# EAGLE design SmartSwitch (EAGLE 7.1.0)
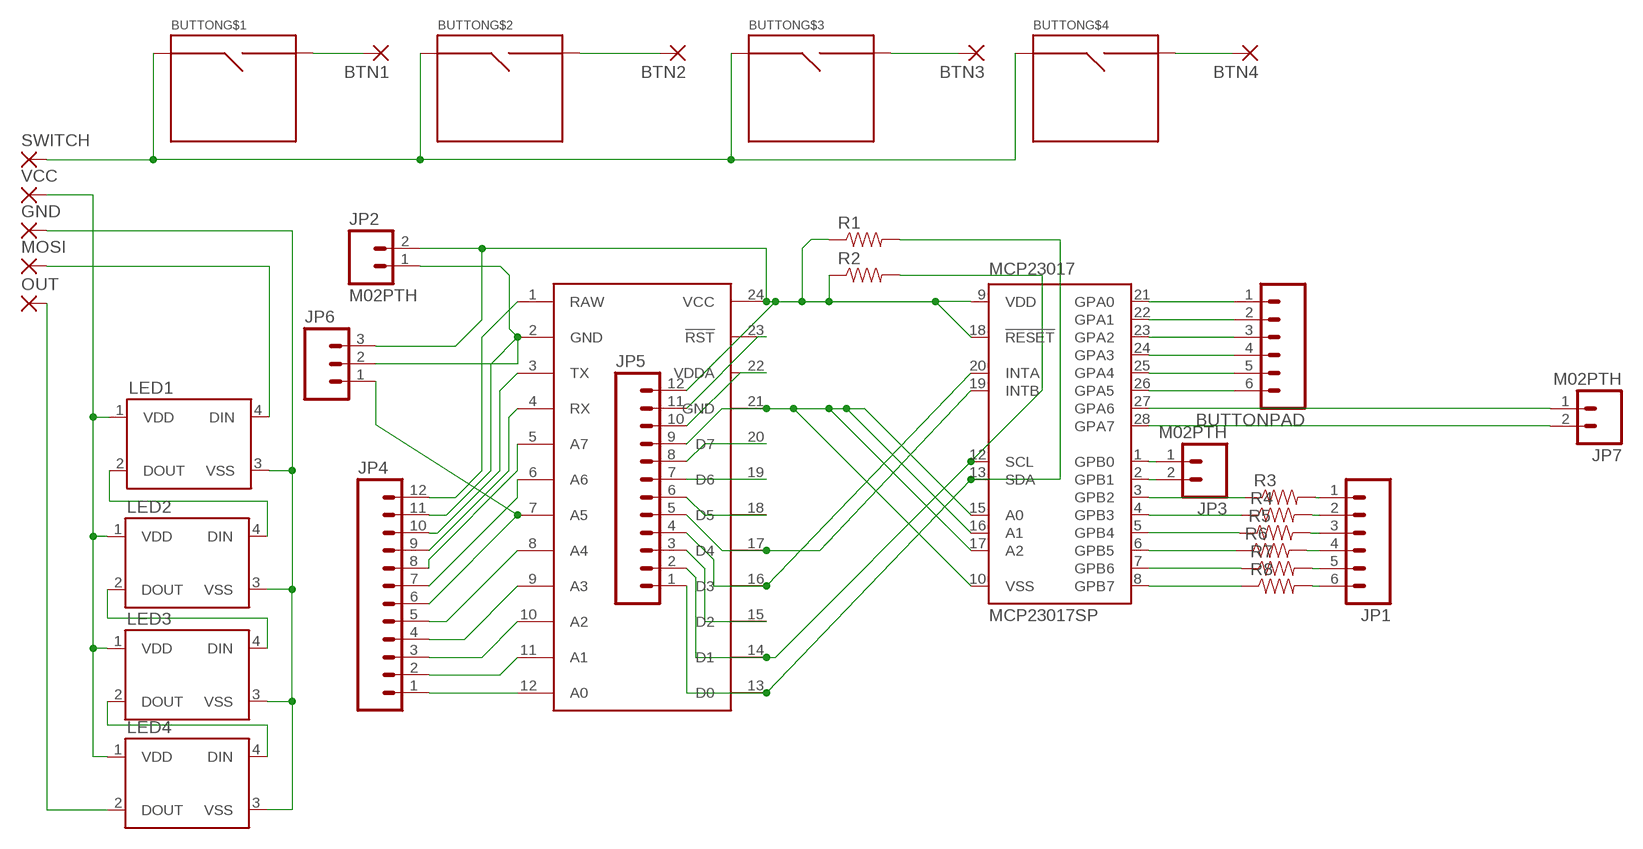
[diagram p0: schematic, sheet 1]

## Parts
BTN1  2,15/1,0  [2,15/1,0]
BTN2  2,15/1,0  [2,15/1,0]
BTN3  2,15/1,0  [2,15/1,0]
BTN4  2,15/1,0  [2,15/1,0]
BUTTON  BUTTON  [BUTTON]
BUTTONPAD  M06SILK_FEMALE_PTH  [1X06]
GND  2,15/1,0  [2,15/1,0]
JP1  M06SILK_FEMALE_PTH  [1X06]
JP2  M02PTH  [1X02]
JP3  M02PTH  [1X02]
JP4  M12PTH  [1X12-SMALL-PADS]
JP5  M12PTH  [1X12-SMALL-PADS]
JP6  M03PTH  [1X03]
JP7  M02PTH  [1X02]
LED1  WS2812B  [WS2812B]
LED2  WS2812B  [WS2812B]
LED3  WS2812B  [WS2812B]
LED4  WS2812B  [WS2812B]
MCP23017  MCP23017SP  [DIL28-3]
MOSI  2,15/1,0  [2,15/1,0]
OUT  2,15/1,0  [2,15/1,0]
R1  RESISTORPTH-1/4W  [AXIAL-0.4]
R2  RESISTORPTH-1/4W  [AXIAL-0.4]
R3  RESISTORPTH-1/4W  [AXIAL-0.4]
R4  RESISTORPTH-1/4W  [AXIAL-0.4]
R5  RESISTORPTH-1/4W  [AXIAL-0.4]
R6  RESISTORPTH-1/4W  [AXIAL-0.4]
R7  RESISTORPTH-1/4W  [AXIAL-0.4]
R8  RESISTORPTH-1/4W  [AXIAL-0.4]
SPARK  SPARK_CORECORE  [SPARK_CORE]
SWITCH  2,15/1,0  [2,15/1,0]
VCC  2,15/1,0  [2,15/1,0]

## Nets
GROUND: GND.1(P) LED1.3(VSS) LED2.3(VSS) LED3.3(VSS) LED4.3(VSS)
MOSI: LED1.4(DIN) MOSI.1(P)
N$1: BTN1.1(P) BUTTON.SIG2
N$2: BTN2.1(P) BUTTON.SIG4(SIG2)
N$3: BTN3.1(P) BUTTON.SIG6(SIG2)
N$4: BTN4.1(P) BUTTON.SIG8(SIG2)
N$5: BUTTONPAD.1 MCP23017.21(GPA0)
N$6: BUTTONPAD.2 MCP23017.22(GPA1)
N$7: BUTTONPAD.3 MCP23017.23(GPA2)
N$8: BUTTONPAD.4 MCP23017.24(GPA3)
N$9: LED4.2(DOUT) OUT.1(P)
N$10: LED1.1(VDD) LED2.1(VDD) LED3.1(VDD) LED4.1(VDD) VCC.1(P)
N$11: LED1.2(DOUT) LED2.4(DIN)
N$12: LED2.2(DOUT) LED3.4(DIN)
N$13: LED3.2(DOUT) LED4.4(DIN)
N$14: BUTTONPAD.5 MCP23017.25(GPA4)
N$15: BUTTONPAD.6 MCP23017.26(GPA5)
N$16: JP7.1 MCP23017.27(GPA6)
N$17: JP7.2 MCP23017.28(GPA7)
N$18: JP3.1 MCP23017.1(GPB0)
N$19: JP3.2 MCP23017.2(GPB1)
N$20: MCP23017.3(GPB2) R3.P$1
N$21: JP1.1 R3.P$2
N$22: JP1.2 R4.P$2
N$23: JP1.3 R5.P$2
N$24: JP1.4 R6.P$2
N$25: JP1.5 R7.P$2
N$26: JP5.3 SPARK.15(D2)
N$27: JP5.5 MCP23017.19(INTB) SPARK.17(D4)
N$28: JP2.2 JP5.12 JP6.3 MCP23017.9(VDD) MCP23017.18(!RESET) R1.P$1 R2.P$1 SPARK.24(VCC)
N$29: JP4.6 JP6.1 SPARK.7(A5)
N$30: JP2.1 JP4.11 JP6.2 SPARK.2(GND)
N$31: JP4.1 SPARK.12(A0)
N$32: JP5.9 MCP23017.10(VSS) MCP23017.15(A0) MCP23017.16(A1) MCP23017.17(A2) SPARK.21(GND)
N$33: JP5.2 MCP23017.12(SCL) R2.P$2 SPARK.14(D1)
N$34: JP5.1 MCP23017.13(SDA) R1.P$2 SPARK.13(D0)
N$35: JP4.2 SPARK.11(A1)
N$36: JP4.3 SPARK.10(A2)
N$37: JP4.4 SPARK.9(A3)
N$38: JP4.5 SPARK.8(A4)
N$39: JP4.7 SPARK.6(A6)
N$40: JP4.8 SPARK.5(A7)
N$41: JP4.9 SPARK.4(RX)
N$42: JP4.10 SPARK.3(TX)
N$43: JP5.6 SPARK.18(D5)
N$44: JP4.12 SPARK.1(RAW)
N$45: JP1.6 R8.P$2
N$46: JP5.8 SPARK.20(D7)
N$47: JP5.7 SPARK.19(D6)
N$48: JP5.10 SPARK.22(VDDA)
N$49: JP5.11 SPARK.23(!RST)
N$50: BUTTON.SIG1 BUTTON.SIG3(SIG1) BUTTON.SIG5(SIG1) BUTTON.SIG7(SIG1) SWITCH.1(P)
N$51: JP5.4 MCP23017.20(INTA) SPARK.16(D3)
N$52: MCP23017.8(GPB7) R8.P$1
N$53: MCP23017.7(GPB6) R7.P$1
N$54: MCP23017.6(GPB5) R6.P$1
N$55: MCP23017.5(GPB4) R5.P$1
N$56: MCP23017.4(GPB3) R4.P$1

## Library data of the parts
BTN1-BTN4 GND MOSI OUT SWITCH VCC = wirepad:2,15/1,0: THROUGH-HOLE PAD
BUTTON = TestLibrary:BUTTON
BUTTONPAD JP1 = SparkFun-Connectors:M06: Header 6 Standard 6-pin 0.1" header. Use with straight break away headers (SKU : PRT-00116), right angle break away headers (PRT-00553), swiss pins (PRT-00743), machine pins (PRT-00117), and female headers (PRT-00115). Molex polarized connector foot print use with SKU : PRT-08094 with associated crimp pins and housings. NOTES ON THE VARIANTS LOCK and LOCK_LONGPADS... This footprint was designed to help hold the alignment of a through-hole component (i.e. 6-pin header) while soldering it into place. You may notice that each hole has been shifted either up or down by 0.005 of an inch from it's more standard position (which is a perfectly straight line). This slight alteration caused the pins (the squares in the middle) to touch the edges of the holes. Because they are alternating, it causes a "brace" to hold the component in place. 0.005 has proven to be the perfect amount of "off-center" position when using our standard breakaway headers. Although looks a little odd when you look at the bare footprint, once you have a header in there, the alteration is very hard to notice. Also,if you push a header all the way into place, it is covered up entirely on the bottom side. This idea of altering the position of holes to aid alignment will be further integrated into the Sparkfun Library for other footprints. It can help hold any component with 3 or more connection pins.; PROD_ID: CONN-08437
JP2 JP3 JP7 = SparkFun-Connectors:M02: Standard 2-pin 0.1" header. Use with - straight break away headers ( PRT-00116) - right angle break away headers (PRT-00553) - swiss pins (PRT-00743) - machine pins (PRT-00117) - female headers (PRT-00115) Molex polarized connector foot print use with: PRT-08233 with associated crimp pins and housings. 2.54_SCREWTERM for use with PRT-10571. 3.5mm Screw Terminal footprints for PRT-08084 5mm Screw Terminal footprints for use with PRT-08432
JP4 JP5 = Spark:M12: Header 12 Standard 12-pin 0.1" header. Use with straight break away headers (SKU : PRT-00116), right angle break away headers (PRT-00553), swiss pins (PRT-00743), machine pins (PRT-00117), and female headers (PRT-00115).
JP6 = SparkFun-Connectors:M03: Header 3 Standard 3-pin 0.1" header. Use with straight break away headers (SKU : PRT-00116), right angle break away headers (PRT-00553), swiss pins (PRT-00743), machine pins (PRT-00117), and female headers (PRT-00115). Molex polarized connector foot print use with SKU : PRT-08232 with associated crimp pins and housings.
LED1-LED4 = SparkFun-LED:WS2812B: WS2812B - Intelligent control LED integrated light source Technical Specifications: Power Supply Voltage (VDD): 3.5 to 5.3 V Input Voltage (VI): -0.5 to VDD+0.5 V Operating Junction Temperature (Topt): -25°C to +80°C Storage Temperature Range (Tstg): -55°C to +150°C
MCP23017 = adafruit:MCP23017: http://ww1.microchip.com/downloads/en/DeviceDoc/21952a.pdf Source: http://ww1.microchip.com/downloads/en/DeviceDoc/21952a.pdf
R1-R8 = SparkFun-Resistors:RESISTOR: Resistor Basic schematic elements and footprints for 0603, 1206, and PTH resistors.
SPARK = Spark:SPARK_CORE

## Board
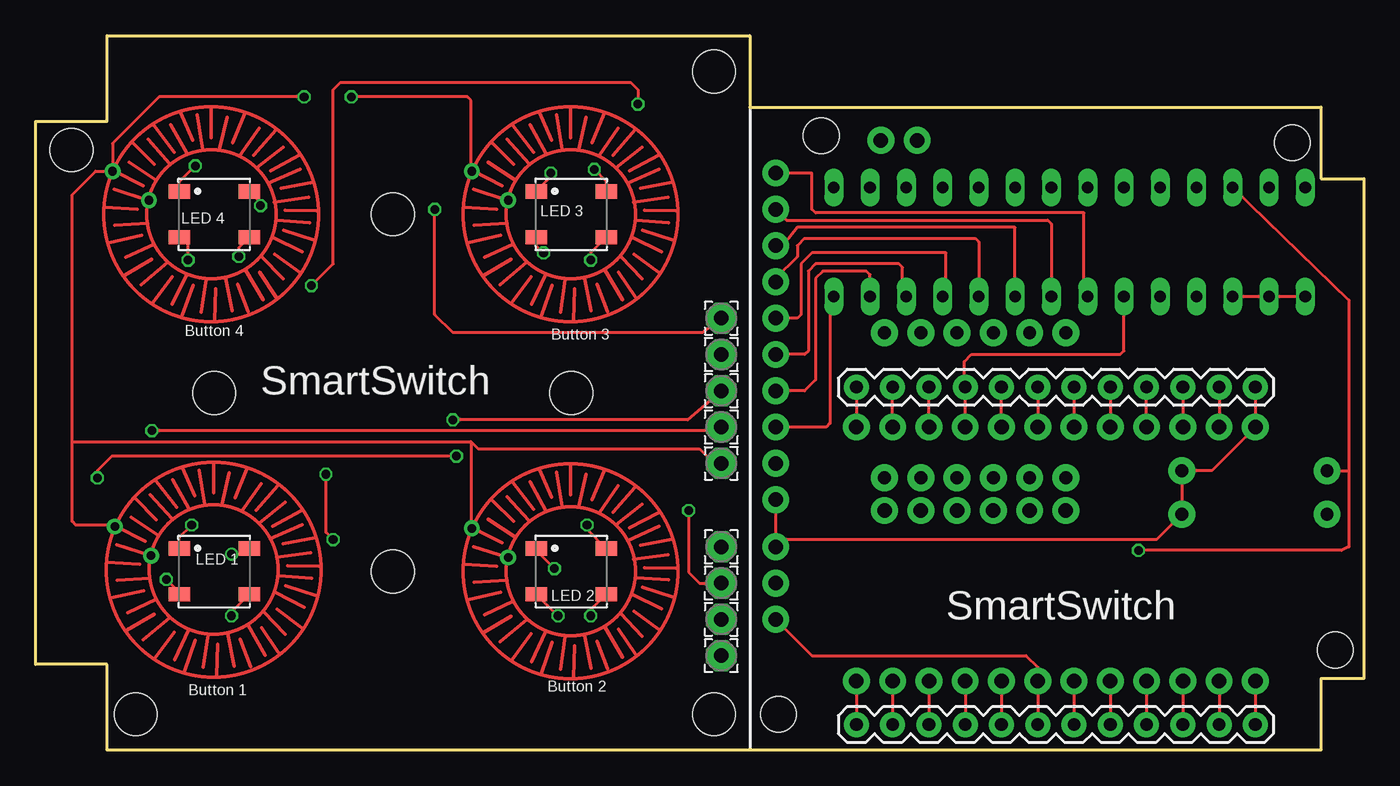
[diagram p1: board, top side]
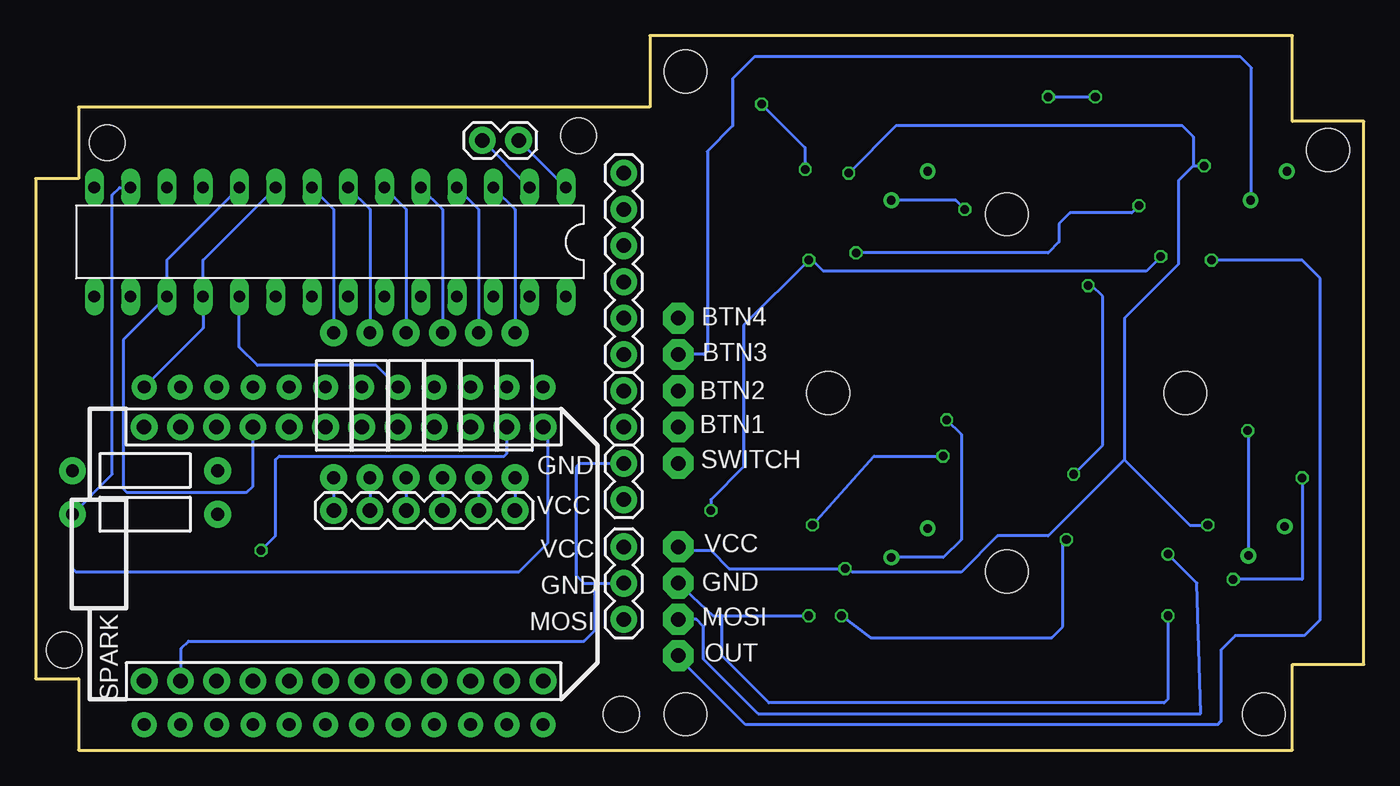
[diagram p2: board, bottom side, seen from below]

Size 93 x 50 mm. Coordinates in mm from the lower left corner, seen from the top.
Outline: 0,6 0,44 5,44 5,50 50,50 50,45 90,45 90,40 93,40 93,5 90,5 90,0 5,0 5,6 0,6
Copper layers (1*16): Top 0.035mm / dielectric 1.5mm / Bottom 0.035mm
Design rules "ITEADstudio_DRC": minimum track width 6mil, minimum drill 12mil, track to track 6mil, track to pad 6mil, pad to pad 6mil, via to via 6mil, smd to smd 0mil, copper to edge 10mil, drill to drill 10mil, minimum pad ring 10mil, minimum via ring 6mil, stop-mask expansion 2mil, vias tented up to drill 100mil, thermal gap 10mil
Holes 3 mm at 12.5,25 25,37.5 37.5,25 25,12.5 7,2.5 2.5,42 47.5,47.5 47.5,2.5
Holes 2.5 mm at 88,42.5 91,7 55,43 52,2.5

### Footprints (pad centres in the part's own frame; a part is rotated, then mirrored left to right if it is on the bottom)
2,15/1,0 = drill 1.016 pad 2.159 octagon: 1 0,0
BUTTON = drill 0.6: SIG1 5.542,15.64; SIG2 8.082,13.608; SIG3 30.542,15.513; SIG4 33.082,13.481; SIG5 5.388,40.513; SIG6 7.928,38.481; SIG7 30.542,40.513; SIG8 33.082,38.481
1X06 = drill 1.016 pad 1.88: 1 0,0; 2 2.54,0; 3 5.08,0; 4 7.62,0; 5 10.16,0; 6 12.7,0
1X02 = drill 1.016 pad 1.88: 1 0,0; 2 2.54,0
1X12-SMALL-PADS = drill 0.889 pad 1.753: 1 0,0; 2 2.54,0; 3 5.08,0; 4 7.62,0; 5 10.16,0; 6 12.7,0; 7 15.24,0; 8 17.78,0; 9 20.32,0; 10 22.86,0; 11 25.4,0; 12 27.94,0
1X03 = drill 1.016 pad 1.88: 1 0,0; 2 2.54,0; 3 5.08,0
WS2812B = smd 1.5 x 1: 1 -2.45,1.6; 2 -2.45,-1.6; 3 2.45,-1.6; 4 2.45,1.6
DIL28-3 = drill 0.813 long: 1 -16.51,-3.81; 2 -13.97,-3.81; 3 -11.43,-3.81; 4 -8.89,-3.81; 5 -6.35,-3.81; 6 -3.81,-3.81; 7 -1.27,-3.81; 8 1.27,-3.81; 9 3.81,-3.81; 10 6.35,-3.81; 11 8.89,-3.81; 12 11.43,-3.81; 13 13.97,-3.81; 14 16.51,-3.81; 15 16.51,3.81; 16 13.97,3.81; 17 11.43,3.81; 18 8.89,3.81; 19 6.35,3.81; 20 3.81,3.81; 21 1.27,3.81; 22 -1.27,3.81; 23 -3.81,3.81; 24 -6.35,3.81; 25 -8.89,3.81; 26 -11.43,3.81; 27 -13.97,3.81; 28 -16.51,3.81
AXIAL-0.4 = drill 0.9 pad 1.88: P$1 -5.08,0; P$2 5.08,0
SPARK_CORE = drill 1.016 pad 1.88: 1 -8.89,13.97; 2 -8.89,11.43; 3 -8.89,8.89; 4 -8.89,6.35; 5 -8.89,3.81; 6 -8.89,1.27; 7 -8.89,-1.27; 8 -8.89,-3.81; 9 -8.89,-6.35; 10 -8.89,-8.89; 11 -8.89,-11.43; 12 -8.89,-13.97; 13 8.89,-13.97; 14 8.89,-11.43; 15 8.89,-8.89; 16 8.89,-6.35; 17 8.89,-3.81; 18 8.89,-1.27; 19 8.89,1.27; 20 8.89,3.81; 21 8.89,6.35; 22 8.89,8.89; 23 8.89,11.43; 24 8.89,13.97

### Placement (x,y rotation side)
BTN1  48.01,22.61 90 top
BTN2  48.01,25.15 90 top
BTN3  48.01,27.69 90 top
BTN4  48.01,30.23 90 top
BUTTON  0,0 0 top
BUTTONPAD  51.82,40.39 270 bottom
GND  48.01,11.68 270 top
JP1  59.44,16.76 180 bottom
JP2  51.82,20.07 270 bottom
JP3  59.18,42.67 180 bottom
JP4  57.47,1.78 0 top
JP5  57.47,25.4 0 top
JP6  51.82,9.14 90 bottom
JP7  51.82,25.15 270 bottom
LED1  12.5,12.5 0 top
LED2  37.5,12.5 0 top
LED3  37.5,37.5 0 top
LED4  12.5,37.5 0 top
MCP23017  72.39,35.56 180 bottom
MOSI  48.01,9.14 270 top
OUT  48.01,6.6 270 top
R1  85.34,16.51 180 bottom
R2  85.34,19.56 180 bottom
R3  59.44,24.13 270 bottom
R4  61.98,24.13 270 bottom
R5  64.52,24.13 270 bottom
R6  67.06,24.13 270 bottom
R7  69.6,24.13 270 bottom
R8  72.14,24.13 270 bottom
SPARK  71.44,13.72 90 bottom
SWITCH  48.01,20.07 180 top
VCC  48.01,14.22 90 top

### Tracks (layer width: path | path; a pad name or v marks a point on that pad's centre or on a via)
GROUND  (via drill 0.6)
  Top 0.203: LED1.3 13.72,9.67 v13.72,9.4 | LED2.3 38.86,9.81 v38.86,9.4 | LED3.3 38.86,34.81 v38.86,34.29 | v45.72,16.76 45.72,12.45 46.48,11.68 GND.1 | LED4.3 14.22,35.17 v14.22,34.54
  Bottom 0.203: GND.1 45.58,9.4 44.96,9.4 | 44.96,9.4 v38.86,9.4 | v13.72,9.4 13.72,3.56 13.97,3.3 41.66,3.3 44.96,6.6 44.96,9.4 | v14.22,34.54 15.24,33.53 37.85,33.53 38.61,34.29 v38.86,34.29 43.43,29.72 43.43,19.81 45.72,17.53 v45.72,16.76
MOSI  (via drill 0.6)
  Top 0.203: v13.72,13.72 14.57,13.72 LED1.4
  Bottom 0.203: v13.72,13.72 11.68,11.68 11.43,2.54 42.42,2.54 46.23,6.35 46.23,8.64 46.74,9.14 MOSI.1
N$1  (via drill 0.6)
  Top 0.203: BTN1.1 46.92,22.35 v8.13,22.35
  Bottom 0.203: v8.13,22.35 8.08,21.8 BUTTON.SIG2
N$2  (via drill 0.6)
  Top 0.203: BTN2.1 45.65,23.11 v29.21,23.11
  Bottom 0.203: v29.21,23.11 28.19,22.1 28.19,14.73 29.45,13.48 BUTTON.SIG4
N$3
  Bottom 0.203: BUTTON.SIG6 7.87,38.53 7.87,47.75 8.64,48.51 42.67,48.51 44.2,46.99 44.2,43.69 45.97,41.91 45.97,27.94 46.23,27.69 BTN3.1
N$4  (via drill 0.6)
  Top 0.203: BTN4.1 46.67,29.21 29.21,29.21 27.94,30.48 v27.94,37.85
  Bottom 0.203: v27.94,37.85 28.57,38.48 BUTTON.SIG8
N$5
  Top 0.203: MCP23017.21 73.41,32 73.41,37.59 54.61,37.59 54.36,37.85 54.36,40.39 BUTTONPAD.1
N$6
  Top 0.203: BUTTONPAD.2 52.58,37.08 70.87,37.08 71.12,36.83 MCP23017.22
N$7
  Top 0.203: MCP23017.23 68.58,36.58 53.34,36.58 52.32,35.31 BUTTONPAD.3
N$8
  Top 0.203: MCP23017.24 66.04,35.56 65.79,35.81 53.85,35.81 53.34,35.31 53.34,34.54 51.82,33.02 BUTTONPAD.4
N$9  (via drill 0.6)
  Top 0.203: v10.67,34.29 10.67,35.81 10.58,35.9 LED4.2
  Bottom 0.203: v10.67,34.29 4.32,34.29 3.05,33.02 3.05,9.11 4.16,8 9,8 10,7 10,2 10.22,1.78 43.29,1.78 48.01,6.5 OUT.1
N$10  (via drill 0.6)
  Top 0.203: LED4.1 10.05,39.77 v11.18,40.89 | v36.07,40.39 36.07,40.12 LED3.1 | LED1.1 10.05,14.88 v10.92,15.75 | v36.32,12.7 35.05,13.97 LED2.1
  Bottom 0.203: v36.07,40.39 32.77,43.69 12.7,43.69 11.94,42.93 11.94,40.89 | 16.76,20.32 16.76,30.23 12.95,34.04 12.95,39.88 11.94,40.89 | 16.76,20.32 12.19,15.75 v10.92,15.75 | VCC.1 47.61,13.97 45.72,13.97 44.45,12.7 v36.32,12.7 36.07,12.7 35.81,12.45 28.19,12.45 25.65,14.99 22.1,14.99 16.76,20.32 | 11.94,40.89 v11.18,40.89
N$11  (via drill 0.6)
  Top 0.203: LED2.4 38.61,15.44 v38.61,15.75 | v29.46,20.57 5.33,20.57 4.32,19.56 v4.32,19.05 | v9.14,11.94 10.05,11.03 LED1.2
  Bottom 0.203: v38.61,15.75 34.29,20.57 v29.46,20.57 | v4.32,19.05 4.32,11.94 v9.14,11.94
N$12  (via drill 0.6)
  Top 0.203: LED2.2 35.81,10.14 v36.58,9.4 | v20.83,14.73 20.32,15.24 v20.32,19.3 | v19.3,32.51 20.83,34.04 20.83,46.23 21.34,46.74 41.66,46.74 42.16,46.23 v42.16,45.21 | v39.12,40.64 39.95,39.81 LED3.4
  Bottom 0.203: v36.58,9.4 34.54,7.87 21.84,7.87 21.08,8.64 21.08,14.48 v20.83,14.73 | v20.32,19.3 18.29,21.34 18.29,31.75 19.05,32.51 v19.3,32.51 | v42.16,45.21 39.12,42.16 v39.12,40.64
N$13  (via drill 0.6)
  Top 0.203: LED4.4 15.75,38.3 v15.75,38.1 | v35.56,34.8 35.05,35.31 LED3.2
  Bottom 0.203: v15.75,38.1 16.26,37.59 20.57,37.59 21.34,36.83 21.34,35.56 22.1,34.8 v35.56,34.8
N$14
  Top 0.203: MCP23017.25 63.75,32 63.75,34.8 54.36,34.8 53.59,34.04 53.59,30.48 53.34,30.23 BUTTONPAD.5
N$15
  Top 0.203: MCP23017.26 60.71,32 60.71,33.78 60.45,34.04 54.61,34.04 54.1,33.53 54.1,27.94 53.85,27.69 BUTTONPAD.6
N$16
  Top 0.203: MCP23017.27 58.42,33.27 58.17,33.53 55.12,33.53 54.61,33.02 54.61,25.91 53.85,25.15 JP7.1
N$17
  Top 0.203: MCP23017.28 55.63,31.5 55.63,22.86 55.37,22.61 JP7.2
N$18
  Bottom 0.203: JP3.1 MCP23017.1
N$19
  Bottom 0.203: JP3.2 MCP23017.2
N$20
  Bottom 0.203: MCP23017.3 59.44,37.85 R3.P$1
N$21
  Bottom 0.203: R3.P$2 JP1.1
N$22
  Bottom 0.203: R4.P$2 JP1.2
N$23
  Bottom 0.203: R5.P$2 JP1.3
N$24
  Bottom 0.203: R6.P$2 JP1.4
N$25
  Bottom 0.203: R7.P$2 JP1.5
N$26
  Top 0.203: SPARK.15 JP5.3
N$27
  Top 0.203: SPARK.17 JP5.5
  Bottom 0.203: JP5.5 69.15,26.92 77.47,26.92 78.74,28.19 MCP23017.19
N$28
  Top 0.203: JP5.12 SPARK.24 82.36,19.56 R2.P$1 R1.P$1 78.49,14.73 51.82,14.73 | JP2.2 51.82,14.73 | 51.82,14.73 JP6.3
  Bottom 0.203: MCP23017.9 81.28,34.29 MCP23017.18 81.28,29.53 JP5.12
N$29
  Top 0.203: JP4.6 SPARK.7 70.17,5.78 69.34,6.6 54.36,6.6 JP6.1
N$30
  Top 0.203: SPARK.2 JP4.11
  Bottom 0.203: JP2.1 54.86,20.07 55.12,19.81 55.12,12.19 54.61,11.68 53.85,11.68 | 53.85,11.68 JP6.2 | SPARK.2 82.8,4.89 82.8,7.11 82.3,7.62 54.61,7.62 53.85,8.38 53.85,11.68
N$31
  Top 0.203: SPARK.12 JP4.1
N$32
  Top 0.203: SPARK.21 JP5.9 | MCP23017.17 MCP23017.16 MCP23017.15
  Bottom 0.203: MCP23017.10 83.82,34.29 MCP23017.17 86.87,28.7 86.87,18.29 86.61,18.03 78.23,18.03 77.79,18.48 SPARK.21
N$33  (via drill 0.6)
  Top 0.203: SPARK.14 JP5.2 | MCP23017.12 91.95,31.5 91.95,19.56 | 91.95,19.56 91.95,14.22 91.44,13.97 v77.22,13.97 | R2.P$2 91.95,19.56
  Bottom 0.203: v77.22,13.97 76.2,14.99 76.2,20.32 75.95,20.57 60.2,20.57 60.01,20.76 SPARK.14
N$34
  Top 0.203: JP5.1 SPARK.13
  Bottom 0.203: MCP23017.13 87.12,39.37 87.63,38.86 87.63,19.3 R1.P$2 90.42,12.7 90.17,12.45 59.18,12.45 57.15,14.48 57.15,22.29 SPARK.13
N$35
  Top 0.203: SPARK.11 JP4.2
N$36
  Top 0.203: SPARK.10 JP4.3
N$37
  Top 0.203: SPARK.9 JP4.4
N$38
  Top 0.203: SPARK.8 JP4.5
N$39
  Top 0.203: SPARK.6 JP4.7
N$40
  Top 0.203: SPARK.5 JP4.8
N$41
  Top 0.203: SPARK.4 JP4.9
N$42
  Top 0.203: SPARK.3 JP4.10
N$43
  Top 0.203: JP5.6 SPARK.18
N$44
  Top 0.203: SPARK.1 JP4.12
N$45
  Bottom 0.203: R8.P$2 JP1.6
N$46
  Top 0.203: JP5.8 SPARK.20
N$47
  Top 0.203: JP5.7 SPARK.19
N$48
  Top 0.203: JP5.10 SPARK.22
N$49
  Top 0.203: JP5.11 SPARK.23
N$50  (via drill 0.6)
  Top 0.203: 30.48,21.59 30.48,15.57 BUTTON.SIG3 | 2.54,21.59 30.48,21.59 | BUTTON.SIG1 5.43,15.75 2.79,15.75 2.54,16 2.54,21.59 | 2.54,21.59 2.54,38.86 4.19,40.51 BUTTON.SIG5 5.39,42.47 8.64,45.72 v18.8,45.72 | BUTTON.SIG7 30.48,40.58 30.48,45.47 30.23,45.72 v22.1,45.72 | 30.48,21.59 30.99,21.08 46.48,21.08 47.5,20.07 SWITCH.1
  Bottom 0.203: v22.1,45.72 v18.8,45.72
N$51
  Top 0.203: SPARK.16 JP5.4 65.02,25.46 65.02,27.18 65.53,27.69 75.95,27.69 76.2,27.94 MCP23017.20
N$52
  Bottom 0.203: MCP23017.8 72.14,37.85 R8.P$1
N$53
  Bottom 0.203: MCP23017.7 69.6,37.85 R7.P$1
N$54
  Bottom 0.203: MCP23017.6 67.06,37.85 R6.P$1
N$55
  Bottom 0.203: MCP23017.5 64.52,37.85 R5.P$1
N$56
  Bottom 0.203: MCP23017.4 61.98,37.85 R4.P$1

### Text on the board
tNames: LED 4 | LED 3 | Button 4 | Button 3 | SmartSwitch | LED 1 | LED 2 | SmartSwitch | Button 1 | Button 2
bNames: GND | VCC | VCC | GND | MOSI